# EAGLE design ad200b (EAGLE 7.7.0)
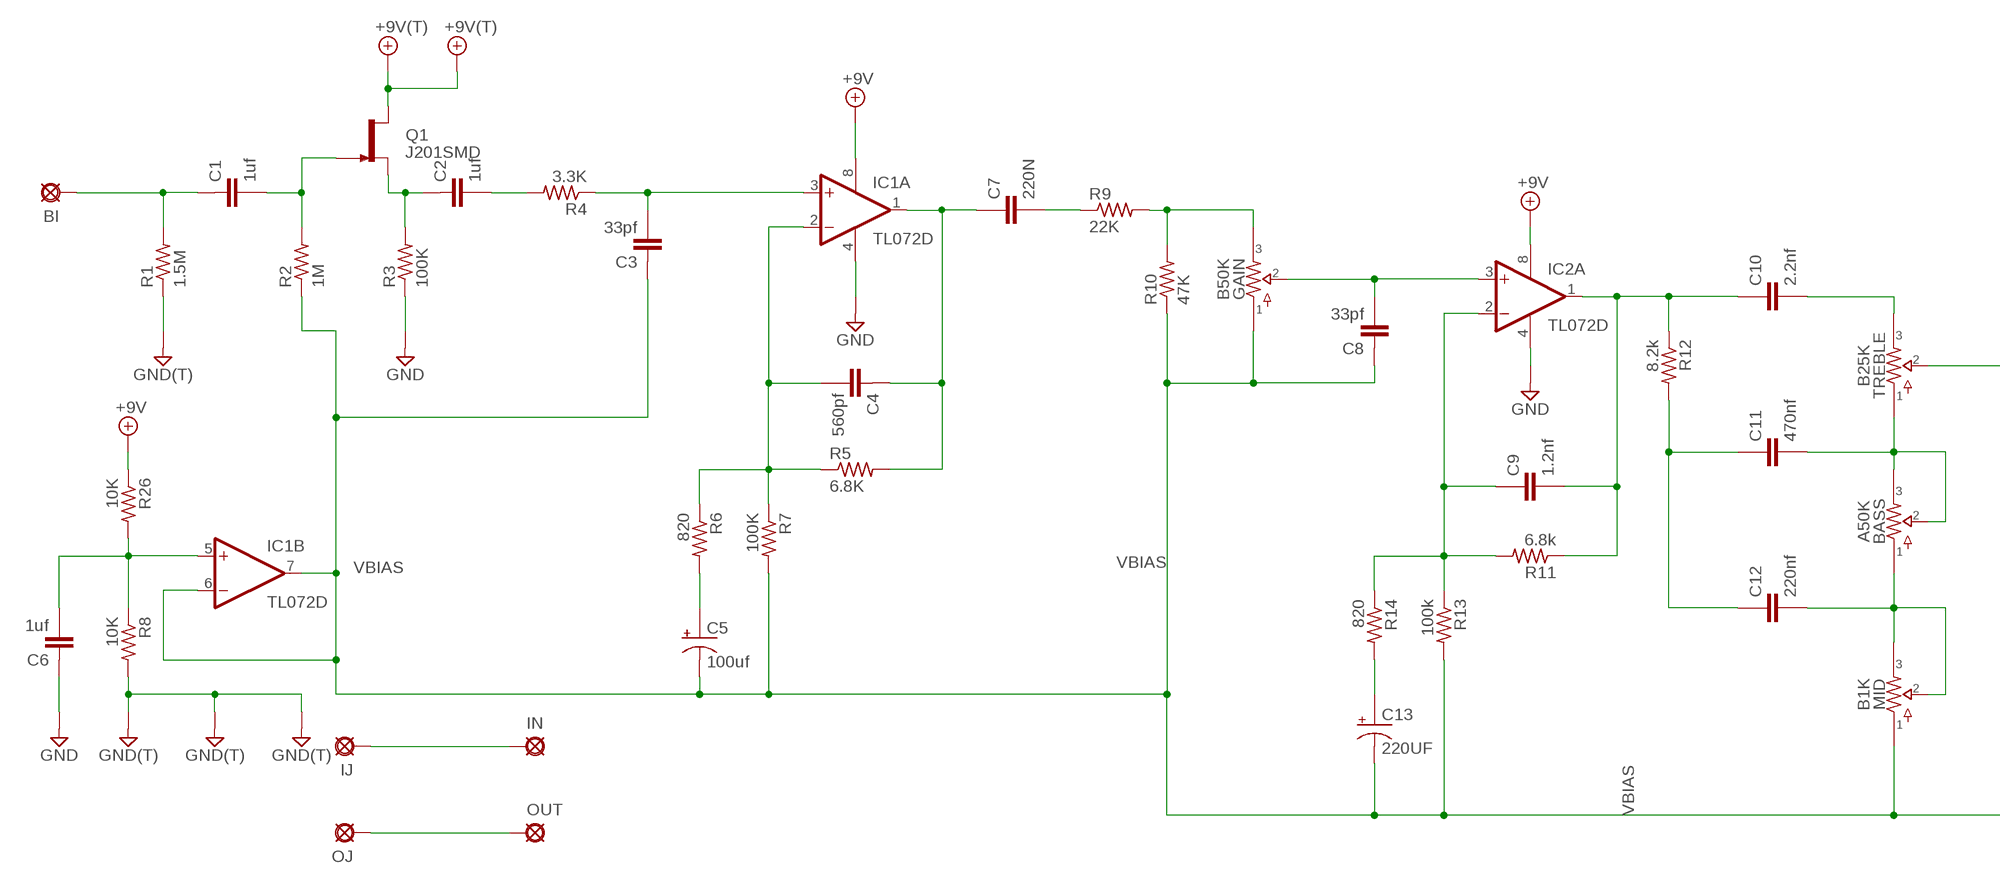
[diagram p0: schematic, sheet 1, part 1 of 2]
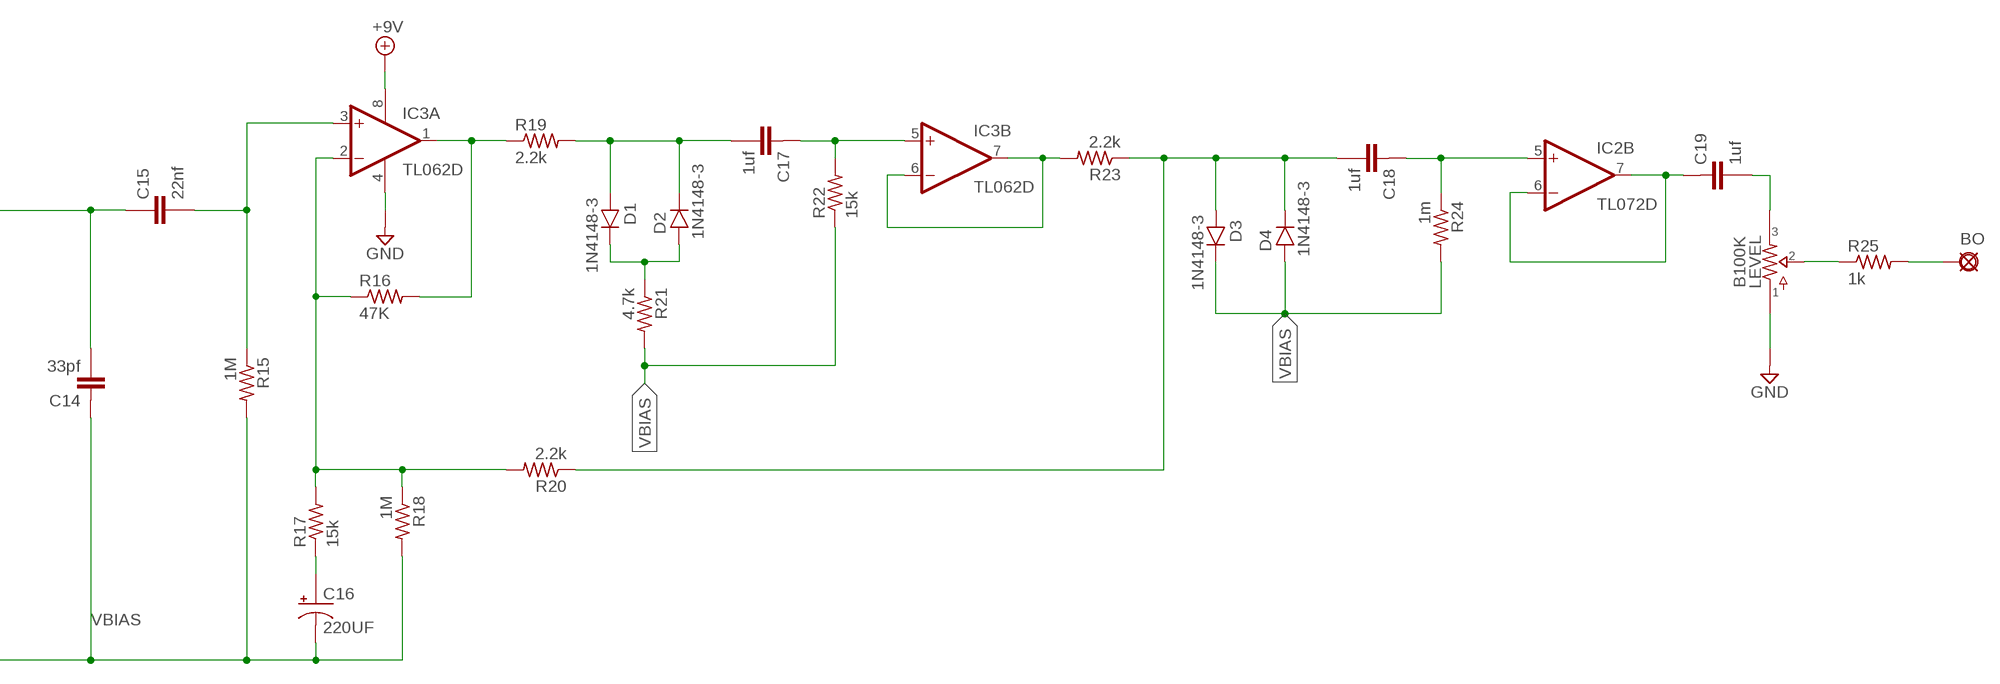
[diagram p1: schematic, sheet 1, part 2 of 2]

## Parts
+V  +9V(T)  [SQUARE]
BASS  A50K  POTS9MM_MOUNTED_2MMH  [9MM_W/MOUNTS-2MMHOLES]
BI  IN  PAD  [SQUARE]
BO  OUT  PAD  [SQUARE]
C1  1uf  050X030_0251  [050X030_025]
C2  1uf  050X030_0251  [050X030_025]
C3  33pf  050X030_0251  [050X030_025]
C4  560pf  050X030_0251  [050X030_025]
C5  100uf  0501  [050_020_1]
C6  1uf  050X030_0251  [050X030_025]
C7  220N  072X0252  [072X025]
C8  33pf  050X030_0251  [050X030_025]
C9  1.2nf  072X0252  [072X025]
C10  2.2nf  072X0252  [072X025]
C11  470nf  072X0252  [072X025]
C12  220nf  072X0252  [072X025]
C13  220UF  0501  [050_020_1]
C14  33pf  050X030_0251  [050X030_025]
C15  22nf  072X0252  [072X025]
C16  220UF  0501  [050_020_1]
C17  1uf  050X030_0251  [050X030_025]
C18  1uf  050X030_0251  [050X030_025]
C19  1uf  050X030_0251  [050X030_025]
D1  1N4148-3  [DO35-3]
D2  1N4148-3  [DO35-3]
D3  1N4148-3  [DO35-3]
D4  1N4148-3  [DO35-3]
G1  GND(T)  [SQUARE]
G2  GND(T)  [SQUARE]
G3  GND(T)  [SQUARE]
G4  GND(T)  [SQUARE]
GAIN  B50K  POTS9MM_MOUNTED_2MMH  [9MM_W/MOUNTS-2MMHOLES]
IC1  TL072D  [SO08]
IC2  TL072D  [SO08]
IC3  TL062D  [SO08]
IJ  PAD8  [OCTOGON]
IN  PAD8  [OCTOGON]
LEVEL  B100K  POTS9MM_MOUNTED_2MMH  [9MM_W/MOUNTS-2MMHOLES]
MID  B1K  POTS9MM_MOUNTED_2MMH  [9MM_W/MOUNTS-2MMHOLES]
OJ  PAD8  [OCTOGON]
OUT  PAD8  [OCTOGON]
Q1  J201SMD  [SOT23]
R1  1.5M  3MM.2  [R0204/2]
R2  1M  3MM.2  [R0204/2]
R3  100K  3MM.2  [R0204/2]
R4  3.3K  3MM.2  [R0204/2]
R5  6.8K  3MM.2  [R0204/2]
R6  820  3MM.2  [R0204/2]
R7  100K  3MM.2  [R0204/2]
R8  10K  3MM.2  [R0204/2]
R9  22K  3MM.2  [R0204/2]
R10  47K  3MM.2  [R0204/2]
R11  6.8k  3MM.2  [R0204/2]
R12  8.2k  3MM.2  [R0204/2]
R13  100k  3MM.2  [R0204/2]
R14  820  3MM.2  [R0204/2]
R15  1M  3MM.2  [R0204/2]
R16  47K  3MM.2  [R0204/2]
R17  15k  3MM.2  [R0204/2]
R18  1M  3MM.2  [R0204/2]
R19  2.2k  3MM.2  [R0204/2]
R20  2.2k  3MM.2  [R0204/2]
R21  4.7k  3MM.2  [R0204/2]
R22  15k  3MM.2  [R0204/2]
R23  2.2k  3MM.2  [R0204/2]
R24  1m  3MM.2  [R0204/2]
R25  1k  3MM.2  [R0204/2]
R26  10K  3MM.2  [R0204/2]
TREBLE  B25K  POTS9MM_MOUNTED_2MMH  [9MM_W/MOUNTS-2MMHOLES]
V  +9V(T)  [SQUARE]

## Nets
+9V: +V.1(+9V) IC1.8(P:V+) IC2.8(P:V+) IC3.8(P:V+) Q1.B(D) R26.1 V.1(+9V)
GND: C6.1 G1.1(GND) G2.1(GND) G3.1(GND) G4.1(GND) IC1.4(P:V-) IC2.4(P:V-) IC3.4(P:V-) LEVEL.P$1 R1.1 R3.1 R8.2
N$1: BI.1(PAD) C1.1 R1.2
N$2: C1.2 Q1.C(G) R2.2
N$3: C2.1 Q1.E(S) R3.2
N$4: C2.2 R4.2
N$5: C6.2 IC1.5(B:+IN) R8.1 R26.2
N$6: C3.2 IC1.3(A:+IN) R4.1
N$7: C4.2 IC1.2(A:-IN) R5.1 R6.1 R7.1
N$8: C4.1 C7.1 IC1.1(A:OUT) R5.2
N$9: C7.2 R9.1
N$10: GAIN.P$3 R9.2 R10.2
N$11: C5.+ R6.2
N$12: C9.2 C10.1 IC2.1(A:OUT) R11.1 R12.1
N$13: BASS.P$1 C12.2 MID.P$2 MID.P$3
N$14: C11.1 C12.1 R12.2
N$15: C8.2 GAIN.P$2 IC2.3(A:+IN)
N$16: IC3.1(A:OUT) R16.2 R19.1
N$17: C17.1 IC3.5(B:+IN) R22.2
N$18: C9.1 IC2.2(A:-IN) R11.2 R13.1 R14.1
N$19: BASS.P$2 BASS.P$3 C11.2 TREBLE.P$1
N$20: C13.+ R14.2
N$21: C17.2 D1.A D2.C R19.2
N$22: C10.2 TREBLE.P$3
N$23: D1.C D2.A R21.1
N$24: C14.2 C15.1 TREBLE.P$2
N$25: IC3.6(B:-IN) IC3.7(B:OUT) R23.2
N$26: C15.2 IC3.3(A:+IN) R15.1
N$27: C18.2 D3.A D4.C R20.1 R23.1
N$28: C19.1 IC2.6(B:-IN) IC2.7(B:OUT)
N$29: C16.+ R17.1
N$30: IJ.1(PAD) IN.1(PAD)
N$31: C19.2 LEVEL.P$3
N$32: IC3.2(A:-IN) R16.1 R17.2 R18.1 R20.2
N$33: C18.1 IC2.5(B:+IN) R24.1
N$34: OJ.1(PAD) OUT.1(PAD)
N$35: LEVEL.P$2 R25.1
N$36: BO.1(PAD) R25.2
VBIAS: C3.1 C5.- C8.1 C13.- C14.1 C16.- D3.C D4.A GAIN.P$1 IC1.6(B:-IN) IC1.7(B:OUT) MID.P$1 R2.1 R7.2 R10.1 R13.2 R15.2 R18.2 R21.2 R22.1 R24.2

## Library data of the parts
+V V = kdd-supply:+9V(T): +9V Voltage Supply use this to hook up +9v throughout a schematic instead of running wire automatically labels the net "+9v" adds a hookup pad to the circuit board
BASS GAIN LEVEL MID TREBLE = kdd-mb-pots:POTS
BI BO IJ IN OJ OUT = kdd-supply:PAD: PAD use this package for pads with any purpose, including input, output, send or return various pad shapes: round, square, octogonal, long, and long offset
C1-C4 C6 C8 C14 C17-C19 = kdd-caps-ceramic:050X030_025: 47 - 120pF Xicon Ceramic Disc 2.5mm lead spacing
C5 C13 C16 = kdd-caps-electro-pol:050: 0.22 - 100uF Xicon values at Mouser.com: 10V: 10 - 100uF; 16V: 2.2 - 47uF; 25V: 0.47 - 47uF; 50V: 0.22 - 22uF
C7 C9-C12 C15 = kdd-caps-film-box:072X025: 1000pF - 0.47uF WIMA MKP2 63, 100V: 1000pF - 0.015uF; MKS2 50V: 0.33 - 0.47uF; 63V: 1000pF - 0.22uF;
D1-D4 = kdd-diodes:1N4148: Fast Switching Diode DO-35 glass case a.k.a. 1N914
G1-G4 = kdd-supply:GND(T): Ground use this to hook up ground (GND) throughout a schematic instead of running wire automatically labels the net "GND" adds a hookup pad to the circuit board (you can use several)
IC1 IC2 = kdd-ics:TL072: OP AMP
IC3 = kdd-ics:TL062: OP AMP
Q1 = kdd-trans:J201: N-channel JFET
R1-R26 = kdd-resistors:3MM: 3mm Resistors Leads spaced 1-6 holes apart for 0.1" perfboard. Suitable for 1/8 watt resistors.

## Board
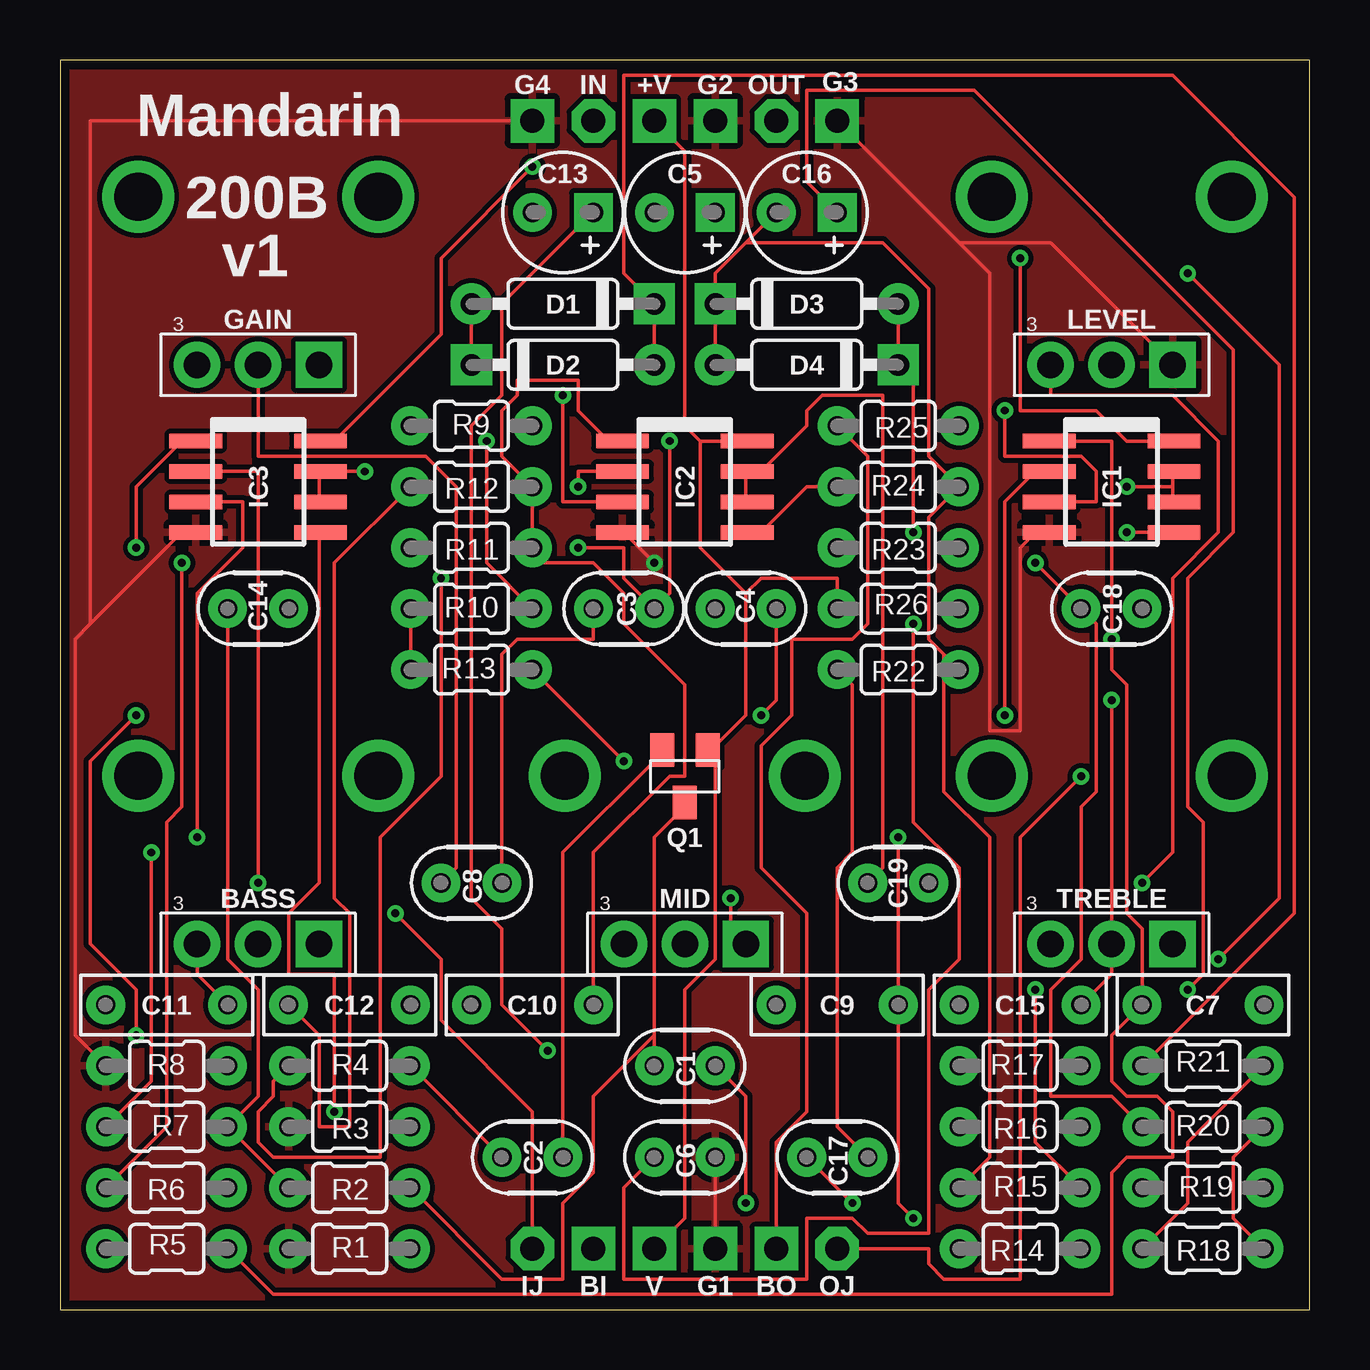
[diagram p2: board, top side]
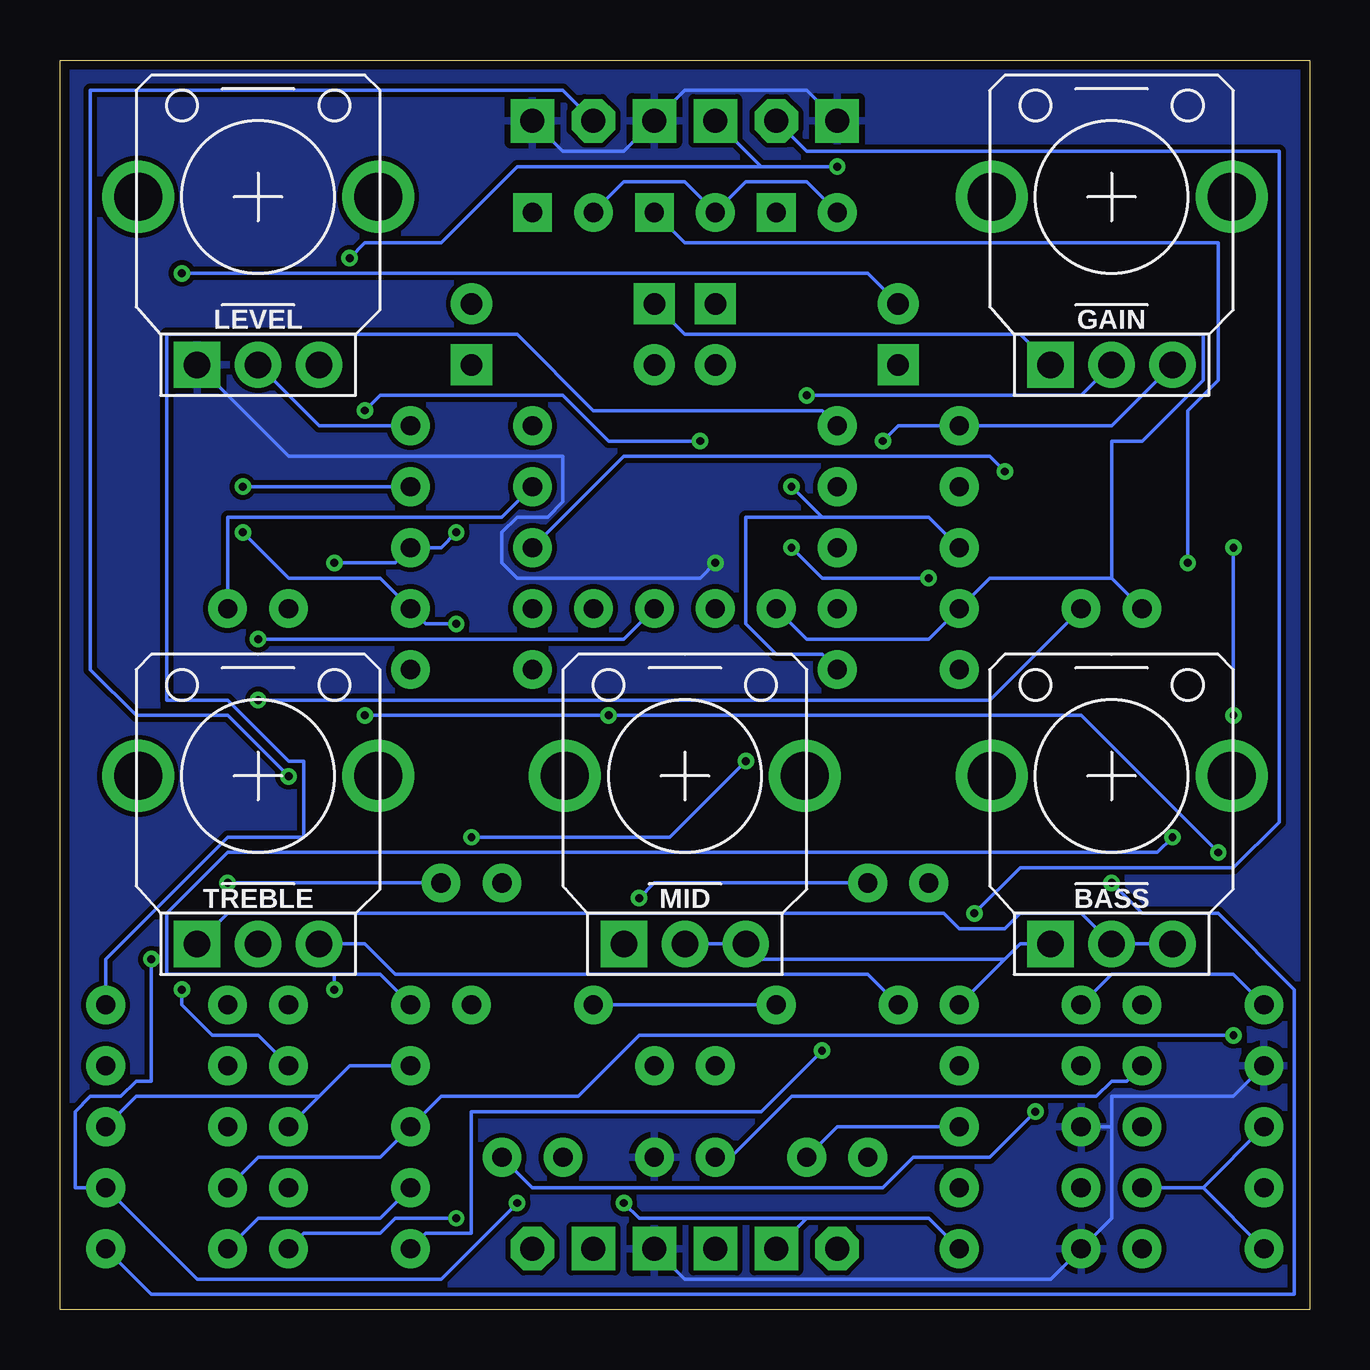
[diagram p3: board, bottom side, seen from below]

Size 52.07 x 52.07 mm. Coordinates in mm from the lower left corner, seen from the top.
Outline: 0,0 52.07,0 52.07,52.07 0,52.06 0,0
Copper layers (1*16): Top 0.0356mm / dielectric 1.5011mm / Bottom 0.0356mm
Design rules "Kyle-OSH": minimum track width 6mil, minimum drill 13mil, track to track 8mil, track to pad 8mil, pad to pad 8mil, via to via 8mil, smd to smd 6mil, copper to edge 15mil, drill to drill 6mil, minimum pad ring 16mil, minimum via ring 7mil, stop-mask expansion 3mil, vias tented up to drill 25mil, thermal gap 10mil

### Footprints (pad centres in the part's own frame; a part is rotated, then mirrored left to right if it is on the bottom)
SQUARE = drill 1 square: 1 0,0
9MM_W/MOUNTS-2MMHOLES = drill 1.1 pad 1.93 square: P$1 2.54,0 | drill 1.1 pad 1.93: P$2 0,0; P$3 -2.54,0 | drill 2: P$4 -5,7; P$5 5,7
050X030_025 = drill 0.8: 1 -1.27,0; 2 1.27,0
050_020_1 = drill 0.8 square: + -1.27,0 | drill 0.8: - 1.27,0
072X025 = drill 0.8: 1 -2.54,0; 2 2.54,0
DO35-3 = drill 0.9: A 3.81,0 | drill 0.9 square: C -3.81,0
SO08 = smd 0.6 x 2.2: 1 -1.905,-2.6; 2 -0.635,-2.6; 3 0.635,-2.6; 4 1.905,-2.6; 5 1.905,2.6; 6 0.635,2.6; 7 -0.635,2.6; 8 -1.905,2.6
OCTOGON = drill 1 octagon: 1 0,0
SOT23 = smd 1 x 1.4: B -0.95,-1.1; C 0,1.1; E 0.95,-1.1
R0204/2 = drill 0.8: 1 -2.54,0; 2 2.54,0

### Placement (x,y rotation side)
+V  24.76,49.53 0 top
BASS  8.26,15.24 0 top
BI  22.22,2.54 0 top
BO  29.84,2.54 0 top
C1  26.04,10.16 180 top
C2  19.68,6.35 180 top
C3  23.49,29.21 0 top
C4  28.57,29.21 0 top
C5  26.04,45.72 180 top
C6  26.04,6.35 180 top
C7  47.62,12.7 0 top
C8  17.14,17.78 180 top
C9  32.39,12.7 180 top
C10  19.68,12.7 180 top
C11  4.45,12.7 0 top
C12  12.06,12.7 0 top
C13  20.95,45.72 180 top
C14  8.26,29.21 0 top
C15  40.01,12.7 180 top
C16  31.11,45.72 180 top
C17  32.39,6.35 180 top
C18  43.82,29.21 180 top
C19  34.93,17.78 0 top
D1  20.95,41.91 180 top
D2  20.95,39.37 0 top
D3  31.11,41.91 0 top
D4  31.11,39.37 180 top
G1  27.3,2.54 0 top
G2  27.3,49.53 0 top
G3  32.39,49.53 90 top
G4  19.68,49.53 0 top
GAIN  8.26,39.37 0 top
IC1  43.82,34.29 270 top
IC2  26.04,34.29 270 top
IC3  8.26,34.29 270 top
IJ  19.68,2.54 0 top
IN  22.22,49.53 0 top
LEVEL  43.82,39.37 0 top
MID  26.04,15.24 0 top
OJ  32.39,2.54 0 top
OUT  29.84,49.53 0 top
Q1  26.04,22.23 180 top
R1  12.06,2.54 0 top
R2  12.06,5.08 0 top
R3  12.06,7.62 0 top
R4  12.06,10.16 0 top
R5  4.45,2.54 0 top
R6  4.45,5.08 180 top
R7  4.45,7.62 0 top
R8  4.45,10.16 180 top
R9  17.14,36.83 180 top
R10  17.14,29.21 0 top
R11  17.14,31.75 180 top
R12  17.14,34.29 180 top
R13  17.14,26.67 180 top
R14  40.01,2.54 180 top
R15  40.01,5.08 180 top
R16  40.01,7.62 180 top
R17  40.01,10.16 180 top
R18  47.62,2.54 180 top
R19  47.62,5.08 0 top
R20  47.62,7.62 0 top
R21  47.62,10.16 0 top
R22  34.93,26.67 180 top
R23  34.93,31.75 180 top
R24  34.93,34.29 0 top
R25  34.93,36.83 180 top
R26  34.93,29.21 0 top
TREBLE  43.82,15.24 0 top
V  24.76,2.54 0 top

### Tracks (layer width: path | path; a pad name or v marks a point on that pad's centre or on a via)
+9V  (via drill 0.33)
  Top 0.152: 28.57,29.84 28.57,24.77 27.3,23.5 Q1.B 27.3,22.86 27.3,14.61 26.04,13.34 26.04,3.81 V.1 | 28.57,29.84 29.21,30.48 32.39,30.48 R26.1 | 26.67,36.2 IC2.8 | 26.67,36.2 26.67,31.75 28.57,29.84 | v19.68,47.62 15.88,43.81 15.88,40.64 11.43,36.2 IC3.8 | IC1.8 44.45,36.2 43.18,37.47 40.01,37.47 v40.01,43.81 | 26.67,36.2 26.04,36.83 26.04,48.26 +V.1
  Bottom 0.152: 22.86,47.62 v19.68,47.62 | +V.1 22.86,47.62 | v40.01,43.81 39.37,44.45 36.2,44.45 33.02,47.62 22.86,47.62
GND  (via drill 0.33)
  Top 0.152: v24.76,31.12 23.49,32.38 IC2.4 | G3.1 37.47,44.45 | 37.47,44.45 38.73,43.18 38.73,24.13 40.01,24.13 40.01,31.75 40.64,32.38 IC1.4 | LEVEL.P$1 41.27,44.45 37.47,44.45 | G1.1 C6.1 | 1.27,28.57 0.64,27.94 0.64,11.43 R8.2 | 1.27,28.57 5.08,32.38 IC3.4 | G4.1 1.27,49.53 1.27,28.57
  Bottom 0.152: v24.76,31.12 25.4,30.48 33.02,30.48 33.66,31.12 33.66,32.38 33.02,33.02 31.75,33.02 31.11,33.66 31.11,35.56 42.55,35.56 LEVEL.P$1 | G4.1 20.95,50.8 26.04,50.8 G2.1 28.57,48.26 31.11,48.26 G3.1 | 8.26,7.62 8.26,3.81 R1.1 10.79,1.27 26.04,1.27 G1.1 | R3.1 8.26,7.62 | 8.26,7.62 8.26,8.89 3.17,8.89 R8.2
  pour Top: -3.17,53.34 55.25,53.34 55.25,-3.81 -3.17,-3.81
  pour Bottom: -4.45,54.61 56.52,54.61 56.52,-5.08 -4.45,-5.08
N$1  (via drill 0.33)
  Top 0.152: C1.1 28.57,8.89 v28.57,4.45
  Bottom 0.152: R1.2 15.88,3.81 20.95,3.81 | BI.1 20.95,3.81 | v28.57,4.45 27.94,3.81 20.95,3.81
N$2
  Top 0.152: C1.2 24.76,11.43 | 24.76,11.43 24.76,19.69 26.04,20.96 Q1.C | R2.2 18.41,1.27 20.95,1.27 20.95,4.45 22.22,5.72 22.22,8.89 24.76,11.43
N$3
  Top 0.152: C2.1 20.95,19.05 24.76,22.86 Q1.E
  Bottom 0.152: R3.2 19.68,7.62 C2.1
N$4
  Top 0.152: R4.2 C2.2
N$5  (via drill 0.33)
  Top 0.152: v44.45,32.38 IC1.5 | v35.56,28.57 35.56,20.32 37.47,18.41 37.47,14.61 36.2,13.34 36.2,3.17 33.66,3.17 33.02,3.81 31.11,3.81 31.11,1.27 23.49,1.27 23.49,5.08 C6.2
  Bottom 0.152: v44.45,32.38 42.55,30.48 38.73,30.48 R26.2 36.83,28.57 v35.56,28.57 | R8.1 7.62,9.52 8.26,9.52 8.89,8.89 21.59,8.89 24.13,6.35 C6.2
N$6  (via drill 0.33)
  Top 0.152: IC1.3 43.18,33.66 43.18,34.93 42.55,35.56 39.37,35.56 v39.37,37.47 | v25.4,36.2 25.4,29.84 C3.2 23.49,30.48 23.49,31.75 v21.59,31.75 | R4.1 8.89,9.52 8.89,8.89 8.26,8.25 8.26,6.99 8.89,6.35 13.34,6.35 13.34,19.69 15.88,22.23 v15.88,30.48
  Bottom 0.152: v39.37,37.47 38.73,38.1 31.11,38.1 29.21,36.2 v25.4,36.2 | v15.88,30.48 20.32,30.48 v21.59,31.75
N$7  (via drill 0.33)
  Top 0.152: v39.37,24.77 39.37,33.66 40.64,34.93 IC1.2 | v29.21,24.77 29.84,25.4 C4.2 | R7.1 3.81,9.52 v3.81,19.05
  Bottom 0.152: 4.45,5.08 R5.1 | R6.1 4.45,5.08 | 4.45,5.08 R7.1 | v39.37,24.77 v29.21,24.77 9.53,24.77 v3.81,19.05
N$8  (via drill 0.33)
  Top 0.152: IC1.1 43.82,36.2 v43.82,27.94 43.82,26.67 44.45,26.04 44.45,16.51 45.09,15.88 C7.1 43.82,11.43 43.82,9.52 44.45,8.89 45.72,8.89 46.36,8.25 46.36,6.35 44.45,6.35 43.82,5.72 43.82,0.63 8.89,0.63 R5.2
  Bottom 0.152: C4.1 28.57,27.94 v43.82,27.94
N$9
  Bottom 0.152: R9.1 20.32,37.47 29.84,37.47 33.02,40.64 47.62,40.64 47.62,25.4 45.09,25.4 42.55,22.86 41.91,22.86 41.91,19.69 45.09,19.69 50.16,14.61 C7.2
N$10  (via drill 0.33)
  Top 0.152: R10.2 17.78,31.12 v17.78,36.2
  Bottom 0.152: v17.78,36.2 17.14,36.83 R9.2 8.26,36.83 GAIN.P$3
N$11  (via drill 0.33)
  Top 0.152: R6.2 4.45,7.62 4.45,20.32 5.08,20.96 v5.08,31.12
  Bottom 0.152: v5.08,31.12 5.08,37.47 3.81,38.73 3.81,44.45 26.04,44.45 C5.+
N$12
  Top 0.152: IC2.1 22.86,36.2 21.59,37.47 21.59,38.73 19.05,38.73 19.05,38.1 18.41,37.47 18.41,35.56 R12.1 R11.1 19.68,31.12 22.22,31.12 23.49,29.84 23.49,28.57 26.04,26.04 26.04,22.23 25.4,22.23 22.22,19.05 C10.1
  Bottom 0.152: C9.2 C10.1
N$13
  Bottom 0.152: MID.P$2 MID.P$3 22.86,14.61 12.7,14.61 | 12.7,14.61 12.06,15.24 BASS.P$1 | 12.7,14.61 C12.2
N$14
  Top 0.152: R12.2 11.43,31.12 11.43,17.14 12.06,16.51 12.06,7.62 10.79,7.62 10.79,11.43 C12.1
  Bottom 0.152: C11.1 3.17,13.97 8.26,13.97 C12.1
N$15  (via drill 0.33)
  Top 0.152: IC2.3 20.95,33.66 v20.95,38.1 | C8.2 16.51,18.41 16.51,34.29 15.24,35.56 8.26,35.56 GAIN.P$2
  Bottom 0.152: v20.95,38.1 9.53,38.1 GAIN.P$2
N$16  (via drill 0.33)
  Top 0.152: v3.17,31.75 3.17,34.29 5.08,36.2 IC3.1 | v3.17,24.77 1.27,22.86 1.27,15.24 3.17,13.34 v3.17,11.43
  Bottom 0.152: v3.17,24.77 v3.17,31.75 | v3.17,11.43 27.94,11.43 30.48,8.89 36.2,8.89 R16.2 38.73,6.35 43.82,6.35 R19.1
N$17  (via drill 0.33)
  Top 0.152: v11.43,8.25 11.43,13.97 9.53,13.97 9.53,16.51 10.79,17.78 10.79,32.38 IC3.5 | R22.2 33.02,26.04 33.02,19.05 32.39,18.41 32.39,7.62 C17.1
  Bottom 0.152: v11.43,8.25 13.34,6.35 16.51,6.35 17.78,5.08 32.39,5.08 C17.1
N$18  (via drill 0.33)
  Top 0.152: IC2.2 21.59,34.93 v21.59,34.29 | v35.56,3.81 34.93,4.45 C9.1 v34.93,19.69 | v23.49,22.86 R13.1
  Bottom 0.152: 20.32,33.02 v21.59,34.29 | 20.32,33.02 15.88,33.02 R11.2 | R13.1 20.32,27.3 22.22,27.3 23.49,28.57 23.49,33.02 20.32,33.02 | R14.1 41.91,3.17 38.73,3.17 38.1,3.81 v35.56,3.81 | v23.49,22.86 26.67,19.69 v34.93,19.69
N$19
  Top 0.152: C11.2 5.71,13.97 BASS.P$3
  Bottom 0.152: BASS.P$3 BASS.P$2 9.53,16.51 12.06,16.51 12.7,15.88 14.61,15.88 15.24,16.51 45.09,16.51 TREBLE.P$1
N$20  (via drill 0.33)
  Top 0.152: v20.32,10.8 18.41,12.7 18.41,15.88 17.14,17.14 17.14,36.83 18.41,38.1 18.41,41.91 C13.+
  Bottom 0.152: R14.2 36.83,3.17 34.93,3.17 34.93,8.25 22.86,8.25 v20.32,10.8
N$21  (via drill 0.33)
  Top 0.152: D1.A D2.C | v33.02,4.45 C17.2 | v46.99,43.18 50.8,39.37 50.8,17.14 v48.26,14.61
  Bottom 0.152: v33.02,4.45 36.2,1.27 46.36,1.27 R19.2 51.44,5.08 51.44,8.25 50.8,8.89 49.53,8.89 48.9,9.52 48.26,9.52 v48.26,14.61 | D1.A 18.41,43.18 v46.99,43.18
N$22
  Bottom 0.152: C10.2 18.41,13.97 38.1,13.97 39.37,15.24 TREBLE.P$3
N$23
  Top 0.152: R21.1 51.44,16.51 51.44,46.36 46.36,51.44 23.49,51.44 23.49,43.18 D1.C D2.A
N$24  (via drill 0.33)
  Top 0.152: v43.82,25.4 TREBLE.P$2 43.82,13.97 C15.1
  Bottom 0.152: C14.2 13.34,25.4 v43.82,25.4
N$25  (via drill 0.33)
  Top 0.152: IC3.6 10.79,33.66 10.79,34.93 IC3.7 v12.7,34.93
  Bottom 0.152: v12.7,34.93 13.34,35.56 28.57,35.56 R23.2
N$26  (via drill 0.33)
  Top 0.152: IC3.3 7.62,33.66 7.62,31.75 5.71,29.84 v5.71,19.69 | R15.1 40.64,6.99 v40.64,13.34
  Bottom 0.152: v5.71,19.69 6.35,19.05 45.09,19.05 47.62,16.51 47.62,13.97 40.64,13.97 | 40.64,13.97 38.73,13.97 C15.2 | 40.64,13.97 v40.64,13.34
N$27  (via drill 0.33)
  Top 0.152: D3.A D4.C 35.56,38.73 v35.56,32.38 | R20.1 43.82,8.89 41.27,8.89 41.27,13.34 42.55,14.61 42.55,20.96 43.18,21.59 43.18,28.57 C18.2 v40.64,31.12
  Bottom 0.152: v40.64,31.12 38.1,31.12 R23.1 36.2,31.75 v35.56,32.38
N$28
  Top 0.152: IC2.6 28.57,33.66 28.57,34.93 IC2.7 29.21,34.93 31.11,36.83 31.11,37.47 31.75,38.1 34.29,38.1 34.29,18.41 C19.1
N$29  (via drill 0.33)
  Top 0.152: v46.99,13.34 47.62,13.97 47.62,20.32 46.99,20.96 46.99,30.48 48.9,32.38 48.9,40.01 38.1,50.8 31.11,50.8 31.11,46.99 C16.+
  Bottom 0.152: R17.1 43.82,11.43 45.72,11.43 46.99,12.7 v46.99,13.34
N$30  (via drill 0.33)
  Top 0.152: IJ.1 19.68,8.25 15.88,12.07 15.88,14.61 v13.97,16.51
  Bottom 0.152: v13.97,16.51 12.06,18.41 3.17,18.41 1.27,20.32 1.27,48.26 20.95,48.26 IN.1
N$31  (via drill 0.33)
  Top 0.152: v45.09,17.78 46.36,19.05 46.36,30.48 48.26,32.38 48.26,36.2 46.36,38.1 41.27,38.1 LEVEL.P$3
  Bottom 0.152: v45.09,17.78 C19.2
N$32  (via drill 0.33)
  Top 0.152: IC3.2 8.26,34.93 v8.26,17.78 | R20.2 48.9,6.35 48.9,3.81 R18.1
  Bottom 0.152: 41.27,8.89 40.01,10.16 R17.2 | 41.27,8.89 R16.1 | R20.2 48.9,8.89 41.27,8.89 | v8.26,17.78 6.99,16.51 3.81,16.51 0.64,13.34 0.64,0.63 48.26,0.63 R18.1
N$33
  Top 0.152: R24.1 31.11,34.29 29.21,32.38 IC2.5
  Bottom 0.152: C18.1 45.09,33.02 33.66,33.02 R24.1
N$34  (via drill 0.33)
  Top 0.152: OJ.1 36.2,2.54 36.2,1.91 36.83,1.27 40.01,1.27 40.01,19.69 v42.55,22.23
  Bottom 0.152: v42.55,22.23 45.09,24.77 48.9,24.77 50.8,26.67 50.8,50.8 31.11,50.8 OUT.1
N$35
  Bottom 0.152: R25.1 41.27,36.83 LEVEL.P$2
N$36
  Top 0.152: R25.2 33.66,35.56 33.66,28.57 33.02,27.94 30.48,27.94 30.48,24.77 29.21,23.5 29.21,18.41 31.11,16.51 31.11,8.25 29.84,6.99 BO.1
VBIAS  (via drill 0.33)
  Top 0.152: C8.1 18.41,27.3 19.05,27.94 22.22,27.94 C3.1 | MID.P$1 27.94,15.88 v27.94,17.14 | R2.1 R7.2 8.26,8.89 8.26,13.34 6.99,14.61 C14.1 | R10.1 R13.2 | R21.2 46.99,6.99 46.99,4.45 R18.2 | 46.36,34.29 46.36,34.93 IC1.7 | 46.36,34.29 46.36,33.66 IC1.6 | v44.45,34.29 46.36,34.29 | 36.83,27.3 36.2,27.94 36.2,33.02 R24.2 36.2,35.56 36.2,42.55 34.29,44.45 28.57,44.45 | 36.83,27.3 R22.1 | 28.57,44.45 27.3,43.18 D3.C D4.A | 28.57,44.45 C16.- | R15.2 38.73,6.35 38.73,19.69 36.83,21.59 36.83,27.3
  Bottom 0.152: v27.94,17.14 27.3,17.78 C8.1 | 8.26,30.48 C14.1 | 8.26,30.48 13.34,30.48 R10.1 15.88,27.94 20.95,27.94 C3.1 | R15.2 38.73,3.81 43.82,3.81 R18.2 | R24.2 v44.45,34.29 | C13.- 20.95,46.99 23.49,46.99 C5.- 26.04,46.99 28.57,46.99 C16.- | 12.06,40.64 GAIN.P$1 | 12.06,40.64 26.04,40.64 D3.C | 8.26,30.48 8.26,36.2 6.99,36.2 4.45,38.73 4.45,40.64 12.06,40.64

### Text on the board
tNames: Mandarin | 200B | v1